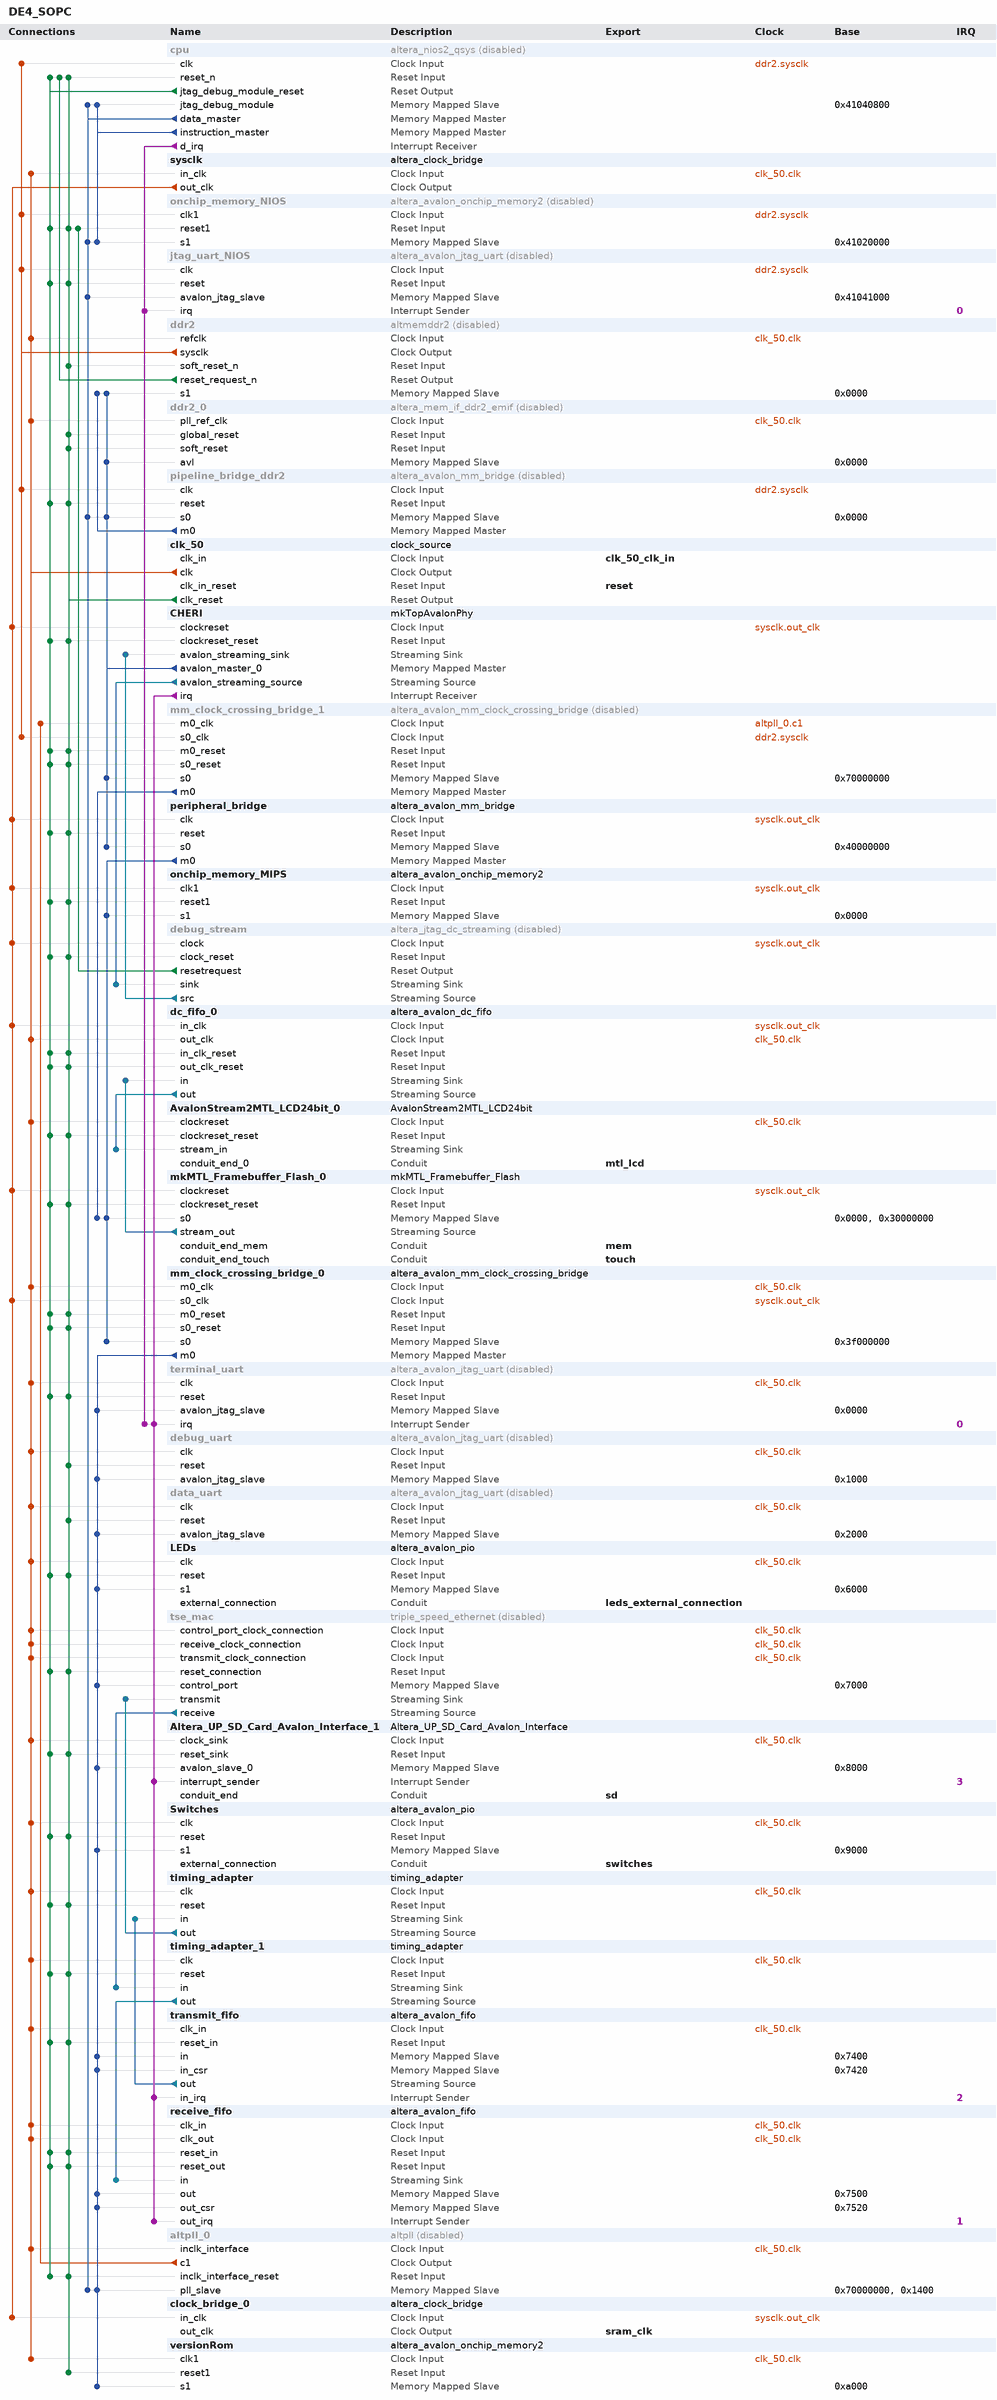
[diagram p0: system contents]
# Platform Designer (Qsys) system DE4_SOPC, Stratix IV Unknown
# Parameters at their usual value, and those the tool derives, are not listed.
package require -exact qsys 12.1
create_system DE4_SOPC
set_project_property DEVICE_FAMILY {Stratix IV}
set_project_property DEVICE Unknown

add_instance cpu altera_nios2_qsys 12.1
set_instance_property cpu ENABLED false
set_instance_parameter_value cpu manuallyAssignCpuID false
set_instance_parameter_value cpu resetSlave onchip_memory_NIOS.s1
set_instance_parameter_value cpu exceptionSlave onchip_memory_NIOS.s1
set_instance_parameter_value cpu breakSlave cpu.jtag_debug_module
set_instance_parameter_value cpu muldiv_multiplierType DSPBlock
set_instance_parameter_value cpu impl Tiny
set_instance_parameter_value cpu icache_size 4096

add_instance sysclk altera_clock_bridge 12.1
set_instance_parameter_value sysclk DERIVED_CLOCK_RATE 50000000
set_instance_parameter_value sysclk EXPLICIT_CLOCK_RATE 0
set_instance_parameter_value sysclk NUM_CLOCK_OUTPUTS 2

add_instance onchip_memory_NIOS altera_avalon_onchip_memory2 12.1
set_instance_property onchip_memory_NIOS ENABLED false
set_instance_parameter_value onchip_memory_NIOS dataWidth 32
set_instance_parameter_value onchip_memory_NIOS dualPort false
set_instance_parameter_value onchip_memory_NIOS initMemContent true
set_instance_parameter_value onchip_memory_NIOS initializationFileName onchip_memory_NIOS
set_instance_parameter_value onchip_memory_NIOS memorySize 131072

add_instance jtag_uart_NIOS altera_avalon_jtag_uart 12.1
set_instance_property jtag_uart_NIOS ENABLED false
set_instance_parameter_value jtag_uart_NIOS simInteractiveOptions INTERACTIVE_ASCII_OUTPUT

add_instance ddr2 altmemddr2 12.1
set_instance_property ddr2 ENABLED false
set_instance_parameter_value ddr2 pipeline_commands false
set_instance_parameter_value ddr2 debug_en false
set_instance_parameter_value ddr2 export_debug_port false
set_instance_parameter_value ddr2 use_generated_memory_model true
set_instance_parameter_value ddr2 dedicated_memory_clk_phase_label {Dedicated memory clock phase:}
set_instance_parameter_value ddr2 mem_if_clk_mhz 208.0
set_instance_parameter_value ddr2 quartus_project_exists false
set_instance_parameter_value ddr2 local_if_drate Half
set_instance_parameter_value ddr2 enable_v72_rsu false
set_instance_parameter_value ddr2 local_if_clk_mhz_label 104.0
set_instance_parameter_value ddr2 new_variant false
set_instance_parameter_value ddr2 mem_if_memtype {DDR2 SDRAM}
set_instance_parameter_value ddr2 pll_ref_clk_mhz 50.0
set_instance_parameter_value ddr2 mem_if_clk_ps_label {(4808 ps)}
set_instance_parameter_value ddr2 family {Stratix IV}
set_instance_parameter_value ddr2 project_family {Stratix IV}
set_instance_parameter_value ddr2 speed_grade 2
set_instance_parameter_value ddr2 dedicated_memory_clk_phase 0
set_instance_parameter_value ddr2 pll_ref_clk_ps_label {(20000 ps)}
set_instance_parameter_value ddr2 avalon_burst_length 1
set_instance_parameter_value ddr2 mem_if_clk_pair_count 2
set_instance_parameter_value ddr2 mem_if_cs_per_dimm 1
set_instance_parameter_value ddr2 pre_latency_label {Fix read latency at:}
set_instance_parameter_value ddr2 dedicated_memory_clk_en false
set_instance_parameter_value ddr2 mirror_addressing 0
set_instance_parameter_value ddr2 mem_if_bankaddr_width 3
set_instance_parameter_value ddr2 register_control_word_9 0000
set_instance_parameter_value ddr2 mem_if_rowaddr_width 14
set_instance_parameter_value ddr2 mem_dyn_deskew_en false
set_instance_parameter_value ddr2 post_latency_label {cycles (0 cycles=minimum latency, non-deterministic)}
set_instance_parameter_value ddr2 mem_if_dm_pins_en Yes
set_instance_parameter_value ddr2 local_if_dwidth_label 256
set_instance_parameter_value ddr2 register_control_word_7 0000
set_instance_parameter_value ddr2 register_control_word_8 0000
set_instance_parameter_value ddr2 mem_if_preset {Custom (DE4_DDR2_800_1GB)}
set_instance_parameter_value ddr2 mem_if_pchaddr_bit 10
set_instance_parameter_value ddr2 WIDTH_RATIO 4
set_instance_parameter_value ddr2 vendor Micron
set_instance_parameter_value ddr2 register_control_word_3 0000
set_instance_parameter_value ddr2 register_control_word_4 0000
set_instance_parameter_value ddr2 chip_or_dimm {Unbuffered DIMM}
set_instance_parameter_value ddr2 register_control_word_5 0000
set_instance_parameter_value ddr2 register_control_word_6 0000
set_instance_parameter_value ddr2 mem_fmax 400.0
set_instance_parameter_value ddr2 register_control_word_0 0000
set_instance_parameter_value ddr2 register_control_word_size 4
set_instance_parameter_value ddr2 register_control_word_1 0000
set_instance_parameter_value ddr2 register_control_word_2 0000
set_instance_parameter_value ddr2 register_control_word_11 0000
set_instance_parameter_value ddr2 register_control_word_10 0000
set_instance_parameter_value ddr2 mem_if_cs_width 1
set_instance_parameter_value ddr2 mem_if_preset_rlat 0
set_instance_parameter_value ddr2 mem_if_cs_per_rank 1
set_instance_parameter_value ddr2 fast_simulation_en FAST
set_instance_parameter_value ddr2 register_control_word_15 0000
set_instance_parameter_value ddr2 register_control_word_14 0000
set_instance_parameter_value ddr2 mem_if_dwidth 64
set_instance_parameter_value ddr2 mem_if_dq_per_dqs 8
set_instance_parameter_value ddr2 mem_if_coladdr_width 10
set_instance_parameter_value ddr2 register_control_word_13 0000
set_instance_parameter_value ddr2 register_control_word_12 0000
set_instance_parameter_value ddr2 mem_tiha_ps 375
set_instance_parameter_value ddr2 mem_tdsh_ck 0.2
set_instance_parameter_value ddr2 mem_if_trfc_ns 127.5
set_instance_parameter_value ddr2 mem_tqh_ck 0.36
set_instance_parameter_value ddr2 mem_tisa_ps 375
set_instance_parameter_value ddr2 mem_tdss_ck 0.2
set_instance_parameter_value ddr2 mem_trtp_ns 7.5
set_instance_parameter_value ddr2 mem_if_tinit_us 200.0
set_instance_parameter_value ddr2 mem_if_trcd_ns 15.0
set_instance_parameter_value ddr2 mem_if_twtr_ck 3
set_instance_parameter_value ddr2 mem_trrd_ns 7.5
set_instance_parameter_value ddr2 mem_tdqss_ck 0.25
set_instance_parameter_value ddr2 mem_tqhs_ps 300
set_instance_parameter_value ddr2 mem_tdsa_ps 250
set_instance_parameter_value ddr2 mem_tac_ps 400
set_instance_parameter_value ddr2 mem_tdha_ps 250
set_instance_parameter_value ddr2 mem_if_tras_ns 40.0
set_instance_parameter_value ddr2 mem_if_twr_ns 15.0
set_instance_parameter_value ddr2 mem_tdqsck_ps 350
set_instance_parameter_value ddr2 mem_if_trp_ns 15.0
set_instance_parameter_value ddr2 mem_tdqsq_ps 200
set_instance_parameter_value ddr2 mem_if_tmrd_ns 5.0
set_instance_parameter_value ddr2 mem_tfaw_ns 37.5
set_instance_parameter_value ddr2 mem_if_trefi_us 7.8
set_instance_parameter_value ddr2 mem_tcl_40_fmax 267.0
set_instance_parameter_value ddr2 mem_odt 50
set_instance_parameter_value ddr2 mp_WLH_percent 0.6
set_instance_parameter_value ddr2 mem_drv_str Normal
set_instance_parameter_value ddr2 mp_DH_percent 0.5
set_instance_parameter_value ddr2 input_period 0
set_instance_parameter_value ddr2 mp_QH_percent 0.5
set_instance_parameter_value ddr2 mp_QHS_percent 0.5
set_instance_parameter_value ddr2 mem_tcl_30_fmax 267.0
set_instance_parameter_value ddr2 ac_clk_select dedicated
set_instance_parameter_value ddr2 mp_DQSQ_percent 0.65
set_instance_parameter_value ddr2 mp_DS_percent 0.6
set_instance_parameter_value ddr2 pll_reconfig_ports_en false
set_instance_parameter_value ddr2 mem_btype Sequential
set_instance_parameter_value ddr2 mp_IS_percent 0.7
set_instance_parameter_value ddr2 mem_tcl 6.0
set_instance_parameter_value ddr2 mp_DQSS_percent 0.5
set_instance_parameter_value ddr2 export_bank_info false
set_instance_parameter_value ddr2 mp_DSS_percent 0.6
set_instance_parameter_value ddr2 mem_dll_en Yes
set_instance_parameter_value ddr2 ac_phase 240
set_instance_parameter_value ddr2 mem_if_oct_en true
set_instance_parameter_value ddr2 mem_tcl_60_fmax 400.0
set_instance_parameter_value ddr2 mp_DSH_percent 0.6
set_instance_parameter_value ddr2 mem_if_dqsn_en true
set_instance_parameter_value ddr2 enable_mp_calibration true
set_instance_parameter_value ddr2 mp_IH_percent 0.6
set_instance_parameter_value ddr2 mem_tcl_15_fmax 533.0
set_instance_parameter_value ddr2 dll_external false
set_instance_parameter_value ddr2 mem_bl 8
set_instance_parameter_value ddr2 mp_WLS_percent 0.7
set_instance_parameter_value ddr2 mem_tcl_50_fmax 334.0
set_instance_parameter_value ddr2 mp_DQSCK_percent 0.5
set_instance_parameter_value ddr2 mem_tcl_25_fmax 533.0
set_instance_parameter_value ddr2 mem_tcl_20_fmax 533.0
set_instance_parameter_value ddr2 cfg_reorder_data false
set_instance_parameter_value ddr2 ctl_ecc_en false
set_instance_parameter_value ddr2 ctl_hrb_en false
set_instance_parameter_value ddr2 ref_clk_source clk_50
set_instance_parameter_value ddr2 cfg_data_reordering_type INTER_BANK
set_instance_parameter_value ddr2 ctl_powerdn_en false
set_instance_parameter_value ddr2 multicast_wr_en false
set_instance_parameter_value ddr2 auto_powerdn_cycles 0
set_instance_parameter_value ddr2 ctl_self_refresh_en false
set_instance_parameter_value ddr2 cfg_starve_limit 10
set_instance_parameter_value ddr2 ctl_latency 0
set_instance_parameter_value ddr2 tool_context SOPC_BUILDER
set_instance_parameter_value ddr2 mem_addr_mapping CHIP_ROW_BANK_COL
set_instance_parameter_value ddr2 burst_merge_en false
set_instance_parameter_value ddr2 user_refresh_en false
set_instance_parameter_value ddr2 qsys_mode true
set_instance_parameter_value ddr2 clk_source_sharing_en false
set_instance_parameter_value ddr2 ctl_lookahead_depth 4
set_instance_parameter_value ddr2 ctl_autopch_en false
set_instance_parameter_value ddr2 ctl_dynamic_bank_allocation false
set_instance_parameter_value ddr2 ctl_dynamic_bank_num 4
set_instance_parameter_value ddr2 local_if_type_avalon true
set_instance_parameter_value ddr2 csr_en false
set_instance_parameter_value ddr2 ctl_auto_correct_en false
set_instance_parameter_value ddr2 auto_powerdn_en false
set_instance_parameter_value ddr2 phy_if_type_afi true
set_instance_parameter_value ddr2 controller_type ddrx_ctl
set_instance_parameter_value ddr2 max_local_size 4
set_instance_parameter_value ddr2 mem_srtr Normal
set_instance_parameter_value ddr2 mem_mpr_loc {Predefined Pattern}
set_instance_parameter_value ddr2 dss_tinit_rst_us 200.0
set_instance_parameter_value ddr2 mem_tcl_90_fmax 400.0
set_instance_parameter_value ddr2 mem_rtt_wr {Dynamic ODT off}
set_instance_parameter_value ddr2 mem_tcl_100_fmax 400.0
set_instance_parameter_value ddr2 mem_pasr {Full Array}
set_instance_parameter_value ddr2 mem_asrm {Manual SR Reference (SRT)}
set_instance_parameter_value ddr2 mem_mpr_oper {Predefined Pattern}
set_instance_parameter_value ddr2 mem_tcl_80_fmax 400.0
set_instance_parameter_value ddr2 mem_drv_impedance RZQ/7
set_instance_parameter_value ddr2 mem_rtt_nom {ODT Disabled}
set_instance_parameter_value ddr2 mem_tcl_70_fmax 400.0
set_instance_parameter_value ddr2 mem_wtcl 5.0
set_instance_parameter_value ddr2 mem_dll_pch {Fast Exit}
set_instance_parameter_value ddr2 mem_atcl Disabled
set_instance_parameter_value ddr2 board_settings_valid true
set_instance_parameter_value ddr2 t_IH 0.375
set_instance_parameter_value ddr2 board_intra_DQS_group_skew 0.02
set_instance_parameter_value ddr2 isi_DQS 0.0
set_instance_parameter_value ddr2 addr_cmd_slew_rate 1.0
set_instance_parameter_value ddr2 board_tpd_inter_DIMM 0.05
set_instance_parameter_value ddr2 board_addresscmd_CK_skew 0.0
set_instance_parameter_value ddr2 t_DS_calculated 0.246
set_instance_parameter_value ddr2 isi_addresscmd_hold 0.0
set_instance_parameter_value ddr2 t_IS 0.375
set_instance_parameter_value ddr2 restore_default_toggle false
set_instance_parameter_value ddr2 dqs_dqsn_slew_rate 4.35
set_instance_parameter_value ddr2 dq_slew_rate 1.39
set_instance_parameter_value ddr2 board_inter_DQS_group_skew 0.02
set_instance_parameter_value ddr2 isi_addresscmd_setup 0.0
set_instance_parameter_value ddr2 board_minCK_DQS_skew -0.01
set_instance_parameter_value ddr2 t_IS_calculated 0.375
set_instance_parameter_value ddr2 num_slots_or_devices 1
set_instance_parameter_value ddr2 board_maxCK_DQS_skew 0.01
set_instance_parameter_value ddr2 board_skew_ps 20
set_instance_parameter_value ddr2 t_DH 0.231
set_instance_parameter_value ddr2 ck_ckn_slew_rate 2.0
set_instance_parameter_value ddr2 isi_DQ 0.0
set_instance_parameter_value ddr2 t_IH_calculated 0.375
set_instance_parameter_value ddr2 t_DH_calculated 0.231
set_instance_parameter_value ddr2 t_DS 0.246

add_instance ddr2_0 altera_mem_if_ddr2_emif 12.1
set_instance_property ddr2_0 ENABLED false
set_instance_parameter_value ddr2_0 MEM_CLK_FREQ 200.0
set_instance_parameter_value ddr2_0 MEM_VENDOR JEDEC
set_instance_parameter_value ddr2_0 MEM_ROW_ADDR_WIDTH 14
set_instance_parameter_value ddr2_0 MEM_COL_ADDR_WIDTH 10
set_instance_parameter_value ddr2_0 MEM_DQ_WIDTH 64
set_instance_parameter_value ddr2_0 MEM_BANKADDR_WIDTH 3
set_instance_parameter_value ddr2_0 MEM_NUMBER_OF_RANKS_PER_DIMM 1
set_instance_parameter_value ddr2_0 MEM_VERBOSE false
set_instance_parameter_value ddr2_0 MEM_BL 4
set_instance_parameter_value ddr2_0 MEM_TCL 6
set_instance_parameter_value ddr2_0 TIMING_TIH 375
set_instance_parameter_value ddr2_0 TIMING_TDQSQ 200
set_instance_parameter_value ddr2_0 TIMING_TQHS 300
set_instance_parameter_value ddr2_0 MEM_TRAS_NS 40.0
set_instance_parameter_value ddr2_0 POWER_OF_TWO_BUS true
set_instance_parameter_value ddr2_0 AVL_MAX_SIZE 8
set_instance_parameter_value ddr2_0 CTL_LOOK_AHEAD_DEPTH 1
set_instance_parameter_value ddr2_0 CFG_REORDER_DATA false
set_instance_parameter_value ddr2_0 REF_CLK_FREQ 50.0
set_instance_parameter_value ddr2_0 DEFAULT_FAST_SIM_MODEL true
set_instance_parameter_value ddr2_0 PLL_SHARING_MODE None
set_instance_parameter_value ddr2_0 EXPORT_AFI_HALF_CLK false
set_instance_parameter_value ddr2_0 SKIP_MEM_INIT false
set_instance_parameter_value ddr2_0 CALIBRATION_MODE Skip
set_instance_parameter_value ddr2_0 USER_DEBUG_LEVEL 0
set_instance_parameter_value ddr2_0 TIMING_BOARD_AC_TO_CK_SKEW 0.0
set_instance_parameter_value ddr2_0 DLL_SHARING_MODE None

add_instance pipeline_bridge_ddr2 altera_avalon_mm_bridge 12.1
set_instance_property pipeline_bridge_ddr2 ENABLED false
set_instance_parameter_value pipeline_bridge_ddr2 DATA_WIDTH 256
set_instance_parameter_value pipeline_bridge_ddr2 ADDRESS_WIDTH 30
set_instance_parameter_value pipeline_bridge_ddr2 ADDRESS_UNITS SYMBOLS
set_instance_parameter_value pipeline_bridge_ddr2 MAX_PENDING_RESPONSES 34
set_instance_parameter_value pipeline_bridge_ddr2 PIPELINE_COMMAND 0
set_instance_parameter_value pipeline_bridge_ddr2 PIPELINE_RESPONSE 0

add_instance clk_50 clock_source 12.1
set_instance_parameter_value clk_50 clockFrequency 50000000

add_instance CHERI mkTopAvalonPhy 1.0

add_instance mm_clock_crossing_bridge_1 altera_avalon_mm_clock_crossing_bridge 12.1
set_instance_property mm_clock_crossing_bridge_1 ENABLED false
set_instance_parameter_value mm_clock_crossing_bridge_1 DATA_WIDTH 256
set_instance_parameter_value mm_clock_crossing_bridge_1 ADDRESS_WIDTH 27
set_instance_parameter_value mm_clock_crossing_bridge_1 MAX_BURST_SIZE 1
set_instance_parameter_value mm_clock_crossing_bridge_1 COMMAND_FIFO_DEPTH 2
set_instance_parameter_value mm_clock_crossing_bridge_1 RESPONSE_FIFO_DEPTH 2
set_instance_parameter_value mm_clock_crossing_bridge_1 MASTER_SYNC_DEPTH 2
set_instance_parameter_value mm_clock_crossing_bridge_1 SLAVE_SYNC_DEPTH 2

add_instance peripheral_bridge altera_avalon_mm_bridge 12.1
set_instance_parameter_value peripheral_bridge DATA_WIDTH 32
set_instance_parameter_value peripheral_bridge ADDRESS_WIDTH 30
set_instance_parameter_value peripheral_bridge ADDRESS_UNITS SYMBOLS
set_instance_parameter_value peripheral_bridge MAX_PENDING_RESPONSES 4

add_instance onchip_memory_MIPS altera_avalon_onchip_memory2 12.1
set_instance_parameter_value onchip_memory_MIPS dataWidth 32
set_instance_parameter_value onchip_memory_MIPS dualPort false
set_instance_parameter_value onchip_memory_MIPS initMemContent true
set_instance_parameter_value onchip_memory_MIPS initializationFileName initial
set_instance_parameter_value onchip_memory_MIPS memorySize 32768
set_instance_parameter_value onchip_memory_MIPS useNonDefaultInitFile true

add_instance debug_stream altera_jtag_dc_streaming 12.1
set_instance_property debug_stream ENABLED false
set_instance_parameter_value debug_stream PURPOSE 0
set_instance_parameter_value debug_stream UPSTREAM_FIFO_SIZE 0
set_instance_parameter_value debug_stream DOWNSTREAM_FIFO_SIZE 0
set_instance_parameter_value debug_stream MGMT_CHANNEL_WIDTH -1
set_instance_parameter_value debug_stream USE_PLI 0
set_instance_parameter_value debug_stream PLI_PORT 50000
set_instance_parameter_value debug_stream USE_DOWNSTREAM_READY 0
set_instance_parameter_value debug_stream COMPONENT_CLOCK 50000000
set_instance_parameter_value debug_stream FABRIC 2.0

add_instance dc_fifo_0 altera_avalon_dc_fifo 12.1
set_instance_parameter_value dc_fifo_0 BITS_PER_SYMBOL 24
set_instance_parameter_value dc_fifo_0 FIFO_DEPTH 32
set_instance_parameter_value dc_fifo_0 USE_PACKETS 1
set_instance_parameter_value dc_fifo_0 WR_SYNC_DEPTH 2
set_instance_parameter_value dc_fifo_0 RD_SYNC_DEPTH 2

add_instance AvalonStream2MTL_LCD24bit_0 AvalonStream2MTL_LCD24bit 1.0

add_instance mkMTL_Framebuffer_Flash_0 mkMTL_Framebuffer_Flash 1.0

add_instance mm_clock_crossing_bridge_0 altera_avalon_mm_clock_crossing_bridge 12.1
set_instance_parameter_value mm_clock_crossing_bridge_0 DATA_WIDTH 32
set_instance_parameter_value mm_clock_crossing_bridge_0 ADDRESS_WIDTH 18
set_instance_parameter_value mm_clock_crossing_bridge_0 MAX_BURST_SIZE 1
set_instance_parameter_value mm_clock_crossing_bridge_0 COMMAND_FIFO_DEPTH 4
set_instance_parameter_value mm_clock_crossing_bridge_0 RESPONSE_FIFO_DEPTH 4
set_instance_parameter_value mm_clock_crossing_bridge_0 MASTER_SYNC_DEPTH 2
set_instance_parameter_value mm_clock_crossing_bridge_0 SLAVE_SYNC_DEPTH 2

add_instance terminal_uart altera_avalon_jtag_uart 12.1
set_instance_property terminal_uart ENABLED false
set_instance_parameter_value terminal_uart simInteractiveOptions INTERACTIVE_ASCII_OUTPUT
set_instance_parameter_value terminal_uart writeBufferDepth 512

add_instance debug_uart altera_avalon_jtag_uart 12.1
set_instance_property debug_uart ENABLED false
set_instance_parameter_value debug_uart simInteractiveOptions INTERACTIVE_ASCII_OUTPUT

add_instance data_uart altera_avalon_jtag_uart 12.1
set_instance_property data_uart ENABLED false
set_instance_parameter_value data_uart simInteractiveOptions INTERACTIVE_ASCII_OUTPUT

add_instance LEDs altera_avalon_pio 12.1
set_instance_parameter_value LEDs direction Output
set_instance_parameter_value LEDs width 8

add_instance tse_mac triple_speed_ethernet 12.1
set_instance_property tse_mac ENABLED false
set_instance_parameter_value tse_mac atlanticSinkClockRate 0
set_instance_parameter_value tse_mac atlanticSinkClockSource unassigned
set_instance_parameter_value tse_mac atlanticSourceClockRate 0
set_instance_parameter_value tse_mac atlanticSourceClockSource unassigned
set_instance_parameter_value tse_mac avalonSlaveClockRate 0
set_instance_parameter_value tse_mac avalonSlaveClockSource unassigned
set_instance_parameter_value tse_mac avalonStNeighbours {unassigned=unassigned}
set_instance_parameter_value tse_mac channel_count 1
set_instance_parameter_value tse_mac core_variation MAC_PCS
set_instance_parameter_value tse_mac core_version 3073
set_instance_parameter_value tse_mac crc32check16bit 0
set_instance_parameter_value tse_mac crc32dwidth 8
set_instance_parameter_value tse_mac crc32gendelay 6
set_instance_parameter_value tse_mac crc32s1l2_extern false
set_instance_parameter_value tse_mac cust_version 0
set_instance_parameter_value tse_mac dataBitsPerSymbol 8
set_instance_parameter_value tse_mac dev_version 3073
set_instance_parameter_value tse_mac eg_addr 11
set_instance_parameter_value tse_mac ena_hash false
set_instance_parameter_value tse_mac enable_alt_reconfig false
set_instance_parameter_value tse_mac enable_clk_sharing false
set_instance_parameter_value tse_mac enable_ena 32
set_instance_parameter_value tse_mac enable_fifoless false
set_instance_parameter_value tse_mac enable_gmii_loopback false
set_instance_parameter_value tse_mac enable_hd_logic false
set_instance_parameter_value tse_mac enable_mac_flow_ctrl false
set_instance_parameter_value tse_mac enable_mac_txaddr_set true
set_instance_parameter_value tse_mac enable_mac_vlan false
set_instance_parameter_value tse_mac enable_maclite false
set_instance_parameter_value tse_mac enable_magic_detect false
set_instance_parameter_value tse_mac enable_multi_channel false
set_instance_parameter_value tse_mac enable_pkt_class true
set_instance_parameter_value tse_mac enable_pma false
set_instance_parameter_value tse_mac enable_ptp_1step false
set_instance_parameter_value tse_mac enable_reg_sharing false
set_instance_parameter_value tse_mac enable_sgmii false
set_instance_parameter_value tse_mac enable_shift16 false
set_instance_parameter_value tse_mac enable_sup_addr false
set_instance_parameter_value tse_mac enable_timestamping false
set_instance_parameter_value tse_mac enable_use_internal_fifo true
set_instance_parameter_value tse_mac export_calblkclk false
set_instance_parameter_value tse_mac export_pwrdn false
set_instance_parameter_value tse_mac ext_stat_cnt_ena false
set_instance_parameter_value tse_mac gigeAdvanceMode true
set_instance_parameter_value tse_mac ifGMII MII_GMII
set_instance_parameter_value tse_mac ifPCSuseEmbeddedSerdes true
set_instance_parameter_value tse_mac ing_addr 11
set_instance_parameter_value tse_mac insert_ta true
set_instance_parameter_value tse_mac maclite_gige false
set_instance_parameter_value tse_mac max_channels 1
set_instance_parameter_value tse_mac mdio_clk_div 40
set_instance_parameter_value tse_mac phy_identifier 0
set_instance_parameter_value tse_mac ramType AUTO
set_instance_parameter_value tse_mac reset_level 1
set_instance_parameter_value tse_mac starting_channel_number 0
set_instance_parameter_value tse_mac stat_cnt_ena false
set_instance_parameter_value tse_mac timingAdapterName timingAdapter
set_instance_parameter_value tse_mac toolContext SOPC_BUILDER
set_instance_parameter_value tse_mac transceiver_type LVDS_IO
set_instance_parameter_value tse_mac tstamp_fp_width 4
set_instance_parameter_value tse_mac uiHostClockFrequency 0
set_instance_parameter_value tse_mac uiMDIOFreq {0.0 MHz}
set_instance_parameter_value tse_mac useLvds true
set_instance_parameter_value tse_mac useMAC true
set_instance_parameter_value tse_mac useMDIO true
set_instance_parameter_value tse_mac usePCS true
set_instance_parameter_value tse_mac use_sync_reset true

add_instance Altera_UP_SD_Card_Avalon_Interface_1 Altera_UP_SD_Card_Avalon_Interface 1.0
set_instance_parameter_value Altera_UP_SD_Card_Avalon_Interface_1 ADDRESS_BUFFER 0
set_instance_parameter_value Altera_UP_SD_Card_Avalon_Interface_1 ADDRESS_CID 128
set_instance_parameter_value Altera_UP_SD_Card_Avalon_Interface_1 ADDRESS_CSD 132
set_instance_parameter_value Altera_UP_SD_Card_Avalon_Interface_1 ADDRESS_OCR 136
set_instance_parameter_value Altera_UP_SD_Card_Avalon_Interface_1 ADDRESS_SR 137
set_instance_parameter_value Altera_UP_SD_Card_Avalon_Interface_1 ADDRESS_RCA 138
set_instance_parameter_value Altera_UP_SD_Card_Avalon_Interface_1 ADDRESS_ARGUMENT 139
set_instance_parameter_value Altera_UP_SD_Card_Avalon_Interface_1 ADDRESS_COMMAND 140
set_instance_parameter_value Altera_UP_SD_Card_Avalon_Interface_1 ADDRESS_ASR 141
set_instance_parameter_value Altera_UP_SD_Card_Avalon_Interface_1 ADDRESS_R1 142

add_instance Switches altera_avalon_pio 12.1
set_instance_parameter_value Switches direction Input
set_instance_parameter_value Switches width 16

add_instance timing_adapter timing_adapter 12.1
set_instance_parameter_value timing_adapter inBitsPerSymbol 8
set_instance_parameter_value timing_adapter inChannelWidth 0
set_instance_parameter_value timing_adapter inErrorWidth 1
set_instance_parameter_value timing_adapter inMaxChannel 0
set_instance_parameter_value timing_adapter inReadyLatency 1
set_instance_parameter_value timing_adapter inSymbolsPerBeat 4
set_instance_parameter_value timing_adapter inUseEmptyPort YES
set_instance_parameter_value timing_adapter inUsePackets true
set_instance_parameter_value timing_adapter inUseReady true
set_instance_parameter_value timing_adapter inUseValid true
set_instance_parameter_value timing_adapter outReadyLatency 0
set_instance_parameter_value timing_adapter outUseReady true
set_instance_parameter_value timing_adapter outUseValid true

add_instance timing_adapter_1 timing_adapter 12.1
set_instance_parameter_value timing_adapter_1 inBitsPerSymbol 8
set_instance_parameter_value timing_adapter_1 inChannelWidth 0
set_instance_parameter_value timing_adapter_1 inErrorWidth 6
set_instance_parameter_value timing_adapter_1 inMaxChannel 0
set_instance_parameter_value timing_adapter_1 inReadyLatency 0
set_instance_parameter_value timing_adapter_1 inSymbolsPerBeat 4
set_instance_parameter_value timing_adapter_1 inUseEmptyPort YES
set_instance_parameter_value timing_adapter_1 inUsePackets true
set_instance_parameter_value timing_adapter_1 inUseReady true
set_instance_parameter_value timing_adapter_1 inUseValid true
set_instance_parameter_value timing_adapter_1 outReadyLatency 1
set_instance_parameter_value timing_adapter_1 outUseReady true
set_instance_parameter_value timing_adapter_1 outUseValid true

add_instance transmit_fifo altera_avalon_fifo 12.1
set_instance_parameter_value transmit_fifo bitsPerSymbol 8
set_instance_parameter_value transmit_fifo channelWidth 0
set_instance_parameter_value transmit_fifo errorWidth 1
set_instance_parameter_value transmit_fifo fifoDepth 16
set_instance_parameter_value transmit_fifo fifoInputInterfaceOptions AVALONMM_WRITE
set_instance_parameter_value transmit_fifo fifoOutputInterfaceOptions AVALONST_SOURCE
set_instance_parameter_value transmit_fifo singleClockMode true
set_instance_parameter_value transmit_fifo symbolsPerBeat 4
set_instance_parameter_value transmit_fifo useIRQ true
set_instance_parameter_value transmit_fifo usePacket true
set_instance_parameter_value transmit_fifo useReadControl false

add_instance receive_fifo altera_avalon_fifo 12.1
set_instance_parameter_value receive_fifo bitsPerSymbol 8
set_instance_parameter_value receive_fifo channelWidth 0
set_instance_parameter_value receive_fifo errorWidth 6
set_instance_parameter_value receive_fifo fifoDepth 16
set_instance_parameter_value receive_fifo fifoInputInterfaceOptions AVALONST_SINK
set_instance_parameter_value receive_fifo fifoOutputInterfaceOptions AVALONMM_READ
set_instance_parameter_value receive_fifo singleClockMode false
set_instance_parameter_value receive_fifo symbolsPerBeat 4
set_instance_parameter_value receive_fifo useIRQ true
set_instance_parameter_value receive_fifo usePacket true
set_instance_parameter_value receive_fifo useReadControl true
set_instance_parameter_value receive_fifo useWriteControl false

add_instance altpll_0 altpll 12.1
set_instance_property altpll_0 ENABLED false
set_instance_parameter_value altpll_0 WIDTH_CLOCK 10
set_instance_parameter_value altpll_0 INCLK0_INPUT_FREQUENCY 20000
set_instance_parameter_value altpll_0 CLK0_MULTIPLY_BY 2
set_instance_parameter_value altpll_0 CLK1_MULTIPLY_BY 2
set_instance_parameter_value altpll_0 CLK2_MULTIPLY_BY 2
set_instance_parameter_value altpll_0 CLK3_MULTIPLY_BY 2
set_instance_parameter_value altpll_0 CLK0_DIVIDE_BY 3
set_instance_parameter_value altpll_0 CLK1_DIVIDE_BY 3
set_instance_parameter_value altpll_0 CLK2_DIVIDE_BY 3
set_instance_parameter_value altpll_0 CLK3_DIVIDE_BY 1
set_instance_parameter_value altpll_0 CLK1_PHASE_SHIFT 0
set_instance_parameter_value altpll_0 CLK2_PHASE_SHIFT 0
set_instance_parameter_value altpll_0 CLK3_PHASE_SHIFT 1000
set_instance_parameter_value altpll_0 CLK1_DUTY_CYCLE 50
set_instance_parameter_value altpll_0 CLK2_DUTY_CYCLE 50
set_instance_parameter_value altpll_0 CLK3_DUTY_CYCLE 50
set_instance_parameter_value altpll_0 PORT_clk1 PORT_USED
set_instance_parameter_value altpll_0 PORT_clk2 PORT_UNUSED
set_instance_parameter_value altpll_0 PORT_clk3 PORT_UNUSED
set_instance_parameter_value altpll_0 PORT_clk6 PORT_UNUSED
set_instance_parameter_value altpll_0 PORT_clk7 PORT_UNUSED
set_instance_parameter_value altpll_0 PORT_clk8 PORT_UNUSED
set_instance_parameter_value altpll_0 PORT_clk9 PORT_UNUSED
set_instance_parameter_value altpll_0 PORT_ARESET PORT_USED
set_instance_parameter_value altpll_0 PORT_LOCKED PORT_USED
set_instance_parameter_value altpll_0 PORT_FBOUT PORT_UNUSED
set_instance_parameter_value altpll_0 USING_FBMIMICBIDIR_PORT OFF

add_instance clock_bridge_0 altera_clock_bridge 12.1
set_instance_parameter_value clock_bridge_0 DERIVED_CLOCK_RATE 50000000
set_instance_parameter_value clock_bridge_0 EXPLICIT_CLOCK_RATE 0

add_instance versionRom altera_avalon_onchip_memory2 12.1
set_instance_parameter_value versionRom dataWidth 32
set_instance_parameter_value versionRom dualPort false
set_instance_parameter_value versionRom initMemContent true
set_instance_parameter_value versionRom initializationFileName version
set_instance_parameter_value versionRom memorySize 20
set_instance_parameter_value versionRom useNonDefaultInitFile true
set_instance_parameter_value versionRom writable false

# connections
add_connection altpll_0.c1 mm_clock_crossing_bridge_1.m0_clk clock
add_connection clk_50.clk Altera_UP_SD_Card_Avalon_Interface_1.clock_sink clock
add_connection clk_50.clk altpll_0.inclk_interface clock
add_connection clk_50.clk AvalonStream2MTL_LCD24bit_0.clockreset clock
add_connection clk_50.clk data_uart.clk clock
add_connection clk_50.clk dc_fifo_0.out_clk clock
add_connection clk_50.clk ddr2.refclk clock
add_connection clk_50.clk ddr2_0.pll_ref_clk clock
add_connection clk_50.clk debug_uart.clk clock
add_connection clk_50.clk LEDs.clk clock
add_connection clk_50.clk mm_clock_crossing_bridge_0.m0_clk clock
add_connection clk_50.clk receive_fifo.clk_in clock
add_connection clk_50.clk receive_fifo.clk_out clock
add_connection clk_50.clk Switches.clk clock
add_connection clk_50.clk sysclk.in_clk clock
add_connection clk_50.clk terminal_uart.clk clock
add_connection clk_50.clk timing_adapter.clk clock
add_connection clk_50.clk timing_adapter_1.clk clock
add_connection clk_50.clk transmit_fifo.clk_in clock
add_connection clk_50.clk tse_mac.control_port_clock_connection clock
add_connection clk_50.clk tse_mac.receive_clock_connection clock
add_connection clk_50.clk tse_mac.transmit_clock_connection clock
add_connection clk_50.clk versionRom.clk1 clock
add_connection ddr2.sysclk cpu.clk clock
add_connection ddr2.sysclk jtag_uart_NIOS.clk clock
add_connection ddr2.sysclk mm_clock_crossing_bridge_1.s0_clk clock
add_connection ddr2.sysclk onchip_memory_NIOS.clk1 clock
add_connection ddr2.sysclk pipeline_bridge_ddr2.clk clock
add_connection sysclk.out_clk CHERI.clockreset clock
add_connection sysclk.out_clk clock_bridge_0.in_clk clock
add_connection sysclk.out_clk dc_fifo_0.in_clk clock
add_connection sysclk.out_clk debug_stream.clock clock
add_connection sysclk.out_clk mkMTL_Framebuffer_Flash_0.clockreset clock
add_connection sysclk.out_clk mm_clock_crossing_bridge_0.s0_clk clock
add_connection sysclk.out_clk onchip_memory_MIPS.clk1 clock
add_connection sysclk.out_clk peripheral_bridge.clk clock
add_connection clk_50.clk_reset Altera_UP_SD_Card_Avalon_Interface_1.reset_sink reset
add_connection clk_50.clk_reset altpll_0.inclk_interface_reset reset
add_connection clk_50.clk_reset AvalonStream2MTL_LCD24bit_0.clockreset_reset reset
add_connection clk_50.clk_reset CHERI.clockreset_reset reset
add_connection clk_50.clk_reset cpu.reset_n reset
add_connection clk_50.clk_reset data_uart.reset reset
add_connection clk_50.clk_reset dc_fifo_0.in_clk_reset reset
add_connection clk_50.clk_reset dc_fifo_0.out_clk_reset reset
add_connection clk_50.clk_reset ddr2.soft_reset_n reset
add_connection clk_50.clk_reset ddr2_0.global_reset reset
add_connection clk_50.clk_reset ddr2_0.soft_reset reset
add_connection clk_50.clk_reset debug_stream.clock_reset reset
add_connection clk_50.clk_reset debug_uart.reset reset
add_connection clk_50.clk_reset jtag_uart_NIOS.reset reset
add_connection clk_50.clk_reset LEDs.reset reset
add_connection clk_50.clk_reset mkMTL_Framebuffer_Flash_0.clockreset_reset reset
add_connection clk_50.clk_reset mm_clock_crossing_bridge_0.m0_reset reset
add_connection clk_50.clk_reset mm_clock_crossing_bridge_0.s0_reset reset
add_connection clk_50.clk_reset mm_clock_crossing_bridge_1.m0_reset reset
add_connection clk_50.clk_reset mm_clock_crossing_bridge_1.s0_reset reset
add_connection clk_50.clk_reset onchip_memory_MIPS.reset1 reset
add_connection clk_50.clk_reset onchip_memory_NIOS.reset1 reset
add_connection clk_50.clk_reset peripheral_bridge.reset reset
add_connection clk_50.clk_reset pipeline_bridge_ddr2.reset reset
add_connection clk_50.clk_reset receive_fifo.reset_in reset
add_connection clk_50.clk_reset receive_fifo.reset_out reset
add_connection clk_50.clk_reset Switches.reset reset
add_connection clk_50.clk_reset terminal_uart.reset reset
add_connection clk_50.clk_reset timing_adapter.reset reset
add_connection clk_50.clk_reset timing_adapter_1.reset reset
add_connection clk_50.clk_reset transmit_fifo.reset_in reset
add_connection clk_50.clk_reset tse_mac.reset_connection reset
add_connection clk_50.clk_reset versionRom.reset1 reset
add_connection cpu.jtag_debug_module_reset Altera_UP_SD_Card_Avalon_Interface_1.reset_sink reset
add_connection cpu.jtag_debug_module_reset altpll_0.inclk_interface_reset reset
add_connection cpu.jtag_debug_module_reset AvalonStream2MTL_LCD24bit_0.clockreset_reset reset
add_connection cpu.jtag_debug_module_reset CHERI.clockreset_reset reset
add_connection cpu.jtag_debug_module_reset cpu.reset_n reset
add_connection cpu.jtag_debug_module_reset dc_fifo_0.in_clk_reset reset
add_connection cpu.jtag_debug_module_reset dc_fifo_0.out_clk_reset reset
add_connection cpu.jtag_debug_module_reset debug_stream.clock_reset reset
add_connection cpu.jtag_debug_module_reset jtag_uart_NIOS.reset reset
add_connection cpu.jtag_debug_module_reset LEDs.reset reset
add_connection cpu.jtag_debug_module_reset mkMTL_Framebuffer_Flash_0.clockreset_reset reset
add_connection cpu.jtag_debug_module_reset mm_clock_crossing_bridge_0.m0_reset reset
add_connection cpu.jtag_debug_module_reset mm_clock_crossing_bridge_0.s0_reset reset
add_connection cpu.jtag_debug_module_reset mm_clock_crossing_bridge_1.m0_reset reset
add_connection cpu.jtag_debug_module_reset mm_clock_crossing_bridge_1.s0_reset reset
add_connection cpu.jtag_debug_module_reset onchip_memory_MIPS.reset1 reset
add_connection cpu.jtag_debug_module_reset onchip_memory_NIOS.reset1 reset
add_connection cpu.jtag_debug_module_reset peripheral_bridge.reset reset
add_connection cpu.jtag_debug_module_reset pipeline_bridge_ddr2.reset reset
add_connection cpu.jtag_debug_module_reset receive_fifo.reset_in reset
add_connection cpu.jtag_debug_module_reset receive_fifo.reset_out reset
add_connection cpu.jtag_debug_module_reset Switches.reset reset
add_connection cpu.jtag_debug_module_reset terminal_uart.reset reset
add_connection cpu.jtag_debug_module_reset timing_adapter.reset reset
add_connection cpu.jtag_debug_module_reset timing_adapter_1.reset reset
add_connection cpu.jtag_debug_module_reset transmit_fifo.reset_in reset
add_connection cpu.jtag_debug_module_reset tse_mac.reset_connection reset
add_connection ddr2.reset_request_n cpu.reset_n reset
add_connection debug_stream.resetrequest onchip_memory_NIOS.reset1 reset
add_connection CHERI.avalon_master_0 ddr2.s1 avalon
set_connection_parameter_value CHERI.avalon_master_0/ddr2.s1 baseAddress 0x0000
add_connection CHERI.avalon_master_0 ddr2_0.avl avalon
set_connection_parameter_value CHERI.avalon_master_0/ddr2_0.avl baseAddress 0x0000
add_connection CHERI.avalon_master_0 mm_clock_crossing_bridge_1.s0 avalon
set_connection_parameter_value CHERI.avalon_master_0/mm_clock_crossing_bridge_1.s0 baseAddress 0x70000000
add_connection CHERI.avalon_master_0 peripheral_bridge.s0 avalon
set_connection_parameter_value CHERI.avalon_master_0/peripheral_bridge.s0 baseAddress 0x40000000
add_connection CHERI.avalon_master_0 pipeline_bridge_ddr2.s0 avalon
set_connection_parameter_value CHERI.avalon_master_0/pipeline_bridge_ddr2.s0 baseAddress 0x0000
add_connection cpu.data_master altpll_0.pll_slave avalon
set_connection_parameter_value cpu.data_master/altpll_0.pll_slave baseAddress 0x70000000
add_connection cpu.data_master cpu.jtag_debug_module avalon
set_connection_parameter_value cpu.data_master/cpu.jtag_debug_module baseAddress 0x41040800
add_connection cpu.data_master jtag_uart_NIOS.avalon_jtag_slave avalon
set_connection_parameter_value cpu.data_master/jtag_uart_NIOS.avalon_jtag_slave baseAddress 0x41041000
add_connection cpu.data_master onchip_memory_NIOS.s1 avalon
set_connection_parameter_value cpu.data_master/onchip_memory_NIOS.s1 baseAddress 0x41020000
add_connection cpu.data_master pipeline_bridge_ddr2.s0 avalon
set_connection_parameter_value cpu.data_master/pipeline_bridge_ddr2.s0 baseAddress 0x0000
add_connection cpu.instruction_master cpu.jtag_debug_module avalon
set_connection_parameter_value cpu.instruction_master/cpu.jtag_debug_module baseAddress 0x41040800
add_connection cpu.instruction_master onchip_memory_NIOS.s1 avalon
set_connection_parameter_value cpu.instruction_master/onchip_memory_NIOS.s1 baseAddress 0x41020000
add_connection mm_clock_crossing_bridge_0.m0 Altera_UP_SD_Card_Avalon_Interface_1.avalon_slave_0 avalon
set_connection_parameter_value mm_clock_crossing_bridge_0.m0/Altera_UP_SD_Card_Avalon_Interface_1.avalon_slave_0 baseAddress 0x8000
add_connection mm_clock_crossing_bridge_0.m0 altpll_0.pll_slave avalon
set_connection_parameter_value mm_clock_crossing_bridge_0.m0/altpll_0.pll_slave baseAddress 0x1400
add_connection mm_clock_crossing_bridge_0.m0 data_uart.avalon_jtag_slave avalon
set_connection_parameter_value mm_clock_crossing_bridge_0.m0/data_uart.avalon_jtag_slave baseAddress 0x2000
add_connection mm_clock_crossing_bridge_0.m0 debug_uart.avalon_jtag_slave avalon
set_connection_parameter_value mm_clock_crossing_bridge_0.m0/debug_uart.avalon_jtag_slave baseAddress 0x1000
add_connection mm_clock_crossing_bridge_0.m0 LEDs.s1 avalon
set_connection_parameter_value mm_clock_crossing_bridge_0.m0/LEDs.s1 baseAddress 0x6000
add_connection mm_clock_crossing_bridge_0.m0 receive_fifo.out avalon
set_connection_parameter_value mm_clock_crossing_bridge_0.m0/receive_fifo.out baseAddress 0x7500
add_connection mm_clock_crossing_bridge_0.m0 receive_fifo.out_csr avalon
set_connection_parameter_value mm_clock_crossing_bridge_0.m0/receive_fifo.out_csr baseAddress 0x7520
add_connection mm_clock_crossing_bridge_0.m0 Switches.s1 avalon
set_connection_parameter_value mm_clock_crossing_bridge_0.m0/Switches.s1 baseAddress 0x9000
add_connection mm_clock_crossing_bridge_0.m0 terminal_uart.avalon_jtag_slave avalon
set_connection_parameter_value mm_clock_crossing_bridge_0.m0/terminal_uart.avalon_jtag_slave baseAddress 0x0000
add_connection mm_clock_crossing_bridge_0.m0 transmit_fifo.in avalon
set_connection_parameter_value mm_clock_crossing_bridge_0.m0/transmit_fifo.in baseAddress 0x7400
add_connection mm_clock_crossing_bridge_0.m0 transmit_fifo.in_csr avalon
set_connection_parameter_value mm_clock_crossing_bridge_0.m0/transmit_fifo.in_csr baseAddress 0x7420
add_connection mm_clock_crossing_bridge_0.m0 tse_mac.control_port avalon
set_connection_parameter_value mm_clock_crossing_bridge_0.m0/tse_mac.control_port baseAddress 0x7000
add_connection mm_clock_crossing_bridge_0.m0 versionRom.s1 avalon
set_connection_parameter_value mm_clock_crossing_bridge_0.m0/versionRom.s1 baseAddress 0xa000
add_connection mm_clock_crossing_bridge_1.m0 mkMTL_Framebuffer_Flash_0.s0 avalon
set_connection_parameter_value mm_clock_crossing_bridge_1.m0/mkMTL_Framebuffer_Flash_0.s0 baseAddress 0x0000
add_connection peripheral_bridge.m0 mkMTL_Framebuffer_Flash_0.s0 avalon
set_connection_parameter_value peripheral_bridge.m0/mkMTL_Framebuffer_Flash_0.s0 baseAddress 0x30000000
add_connection peripheral_bridge.m0 mm_clock_crossing_bridge_0.s0 avalon
set_connection_parameter_value peripheral_bridge.m0/mm_clock_crossing_bridge_0.s0 baseAddress 0x3f000000
add_connection peripheral_bridge.m0 onchip_memory_MIPS.s1 avalon
set_connection_parameter_value peripheral_bridge.m0/onchip_memory_MIPS.s1 baseAddress 0x0000
add_connection pipeline_bridge_ddr2.m0 ddr2.s1 avalon
set_connection_parameter_value pipeline_bridge_ddr2.m0/ddr2.s1 baseAddress 0x0000
add_connection CHERI.avalon_streaming_source debug_stream.sink avalon_streaming
add_connection dc_fifo_0.out AvalonStream2MTL_LCD24bit_0.stream_in avalon_streaming
add_connection debug_stream.src CHERI.avalon_streaming_sink avalon_streaming
add_connection mkMTL_Framebuffer_Flash_0.stream_out dc_fifo_0.in avalon_streaming
add_connection timing_adapter.out tse_mac.transmit avalon_streaming
add_connection timing_adapter_1.out receive_fifo.in avalon_streaming
add_connection transmit_fifo.out timing_adapter.in avalon_streaming
add_connection tse_mac.receive timing_adapter_1.in avalon_streaming
add_connection CHERI.irq Altera_UP_SD_Card_Avalon_Interface_1.interrupt_sender interrupt
set_connection_parameter_value CHERI.irq/Altera_UP_SD_Card_Avalon_Interface_1.interrupt_sender irqNumber 3
add_connection CHERI.irq receive_fifo.out_irq interrupt
set_connection_parameter_value CHERI.irq/receive_fifo.out_irq irqNumber 1
add_connection CHERI.irq terminal_uart.irq interrupt
set_connection_parameter_value CHERI.irq/terminal_uart.irq irqNumber 0
add_connection CHERI.irq transmit_fifo.in_irq interrupt
set_connection_parameter_value CHERI.irq/transmit_fifo.in_irq irqNumber 2
add_connection cpu.d_irq jtag_uart_NIOS.irq interrupt
set_connection_parameter_value cpu.d_irq/jtag_uart_NIOS.irq irqNumber 0
add_connection cpu.d_irq terminal_uart.irq interrupt
set_connection_parameter_value cpu.d_irq/terminal_uart.irq irqNumber 2

# exported interfaces
add_interface clk_50_clk_in clock sink
set_interface_property clk_50_clk_in EXPORT_OF clk_50.clk_in
add_interface leds_external_connection conduit end
set_interface_property leds_external_connection EXPORT_OF LEDs.external_connection
add_interface mtl_lcd conduit end
set_interface_property mtl_lcd EXPORT_OF AvalonStream2MTL_LCD24bit_0.conduit_end_0
add_interface touch conduit end
set_interface_property touch EXPORT_OF mkMTL_Framebuffer_Flash_0.conduit_end_touch
add_interface mem conduit end
set_interface_property mem EXPORT_OF mkMTL_Framebuffer_Flash_0.conduit_end_mem
add_interface sd conduit end
set_interface_property sd EXPORT_OF Altera_UP_SD_Card_Avalon_Interface_1.conduit_end
add_interface switches conduit end
set_interface_property switches EXPORT_OF Switches.external_connection
add_interface reset reset sink
set_interface_property reset EXPORT_OF clk_50.clk_in_reset
add_interface sram_clk clock source
set_interface_property sram_clk EXPORT_OF clock_bridge_0.out_clk

save_system DE4_SOPC.qsys
